# Altium schematic sheet Кнопки_2024-08-19.schdoc
size 404 x 412 mm
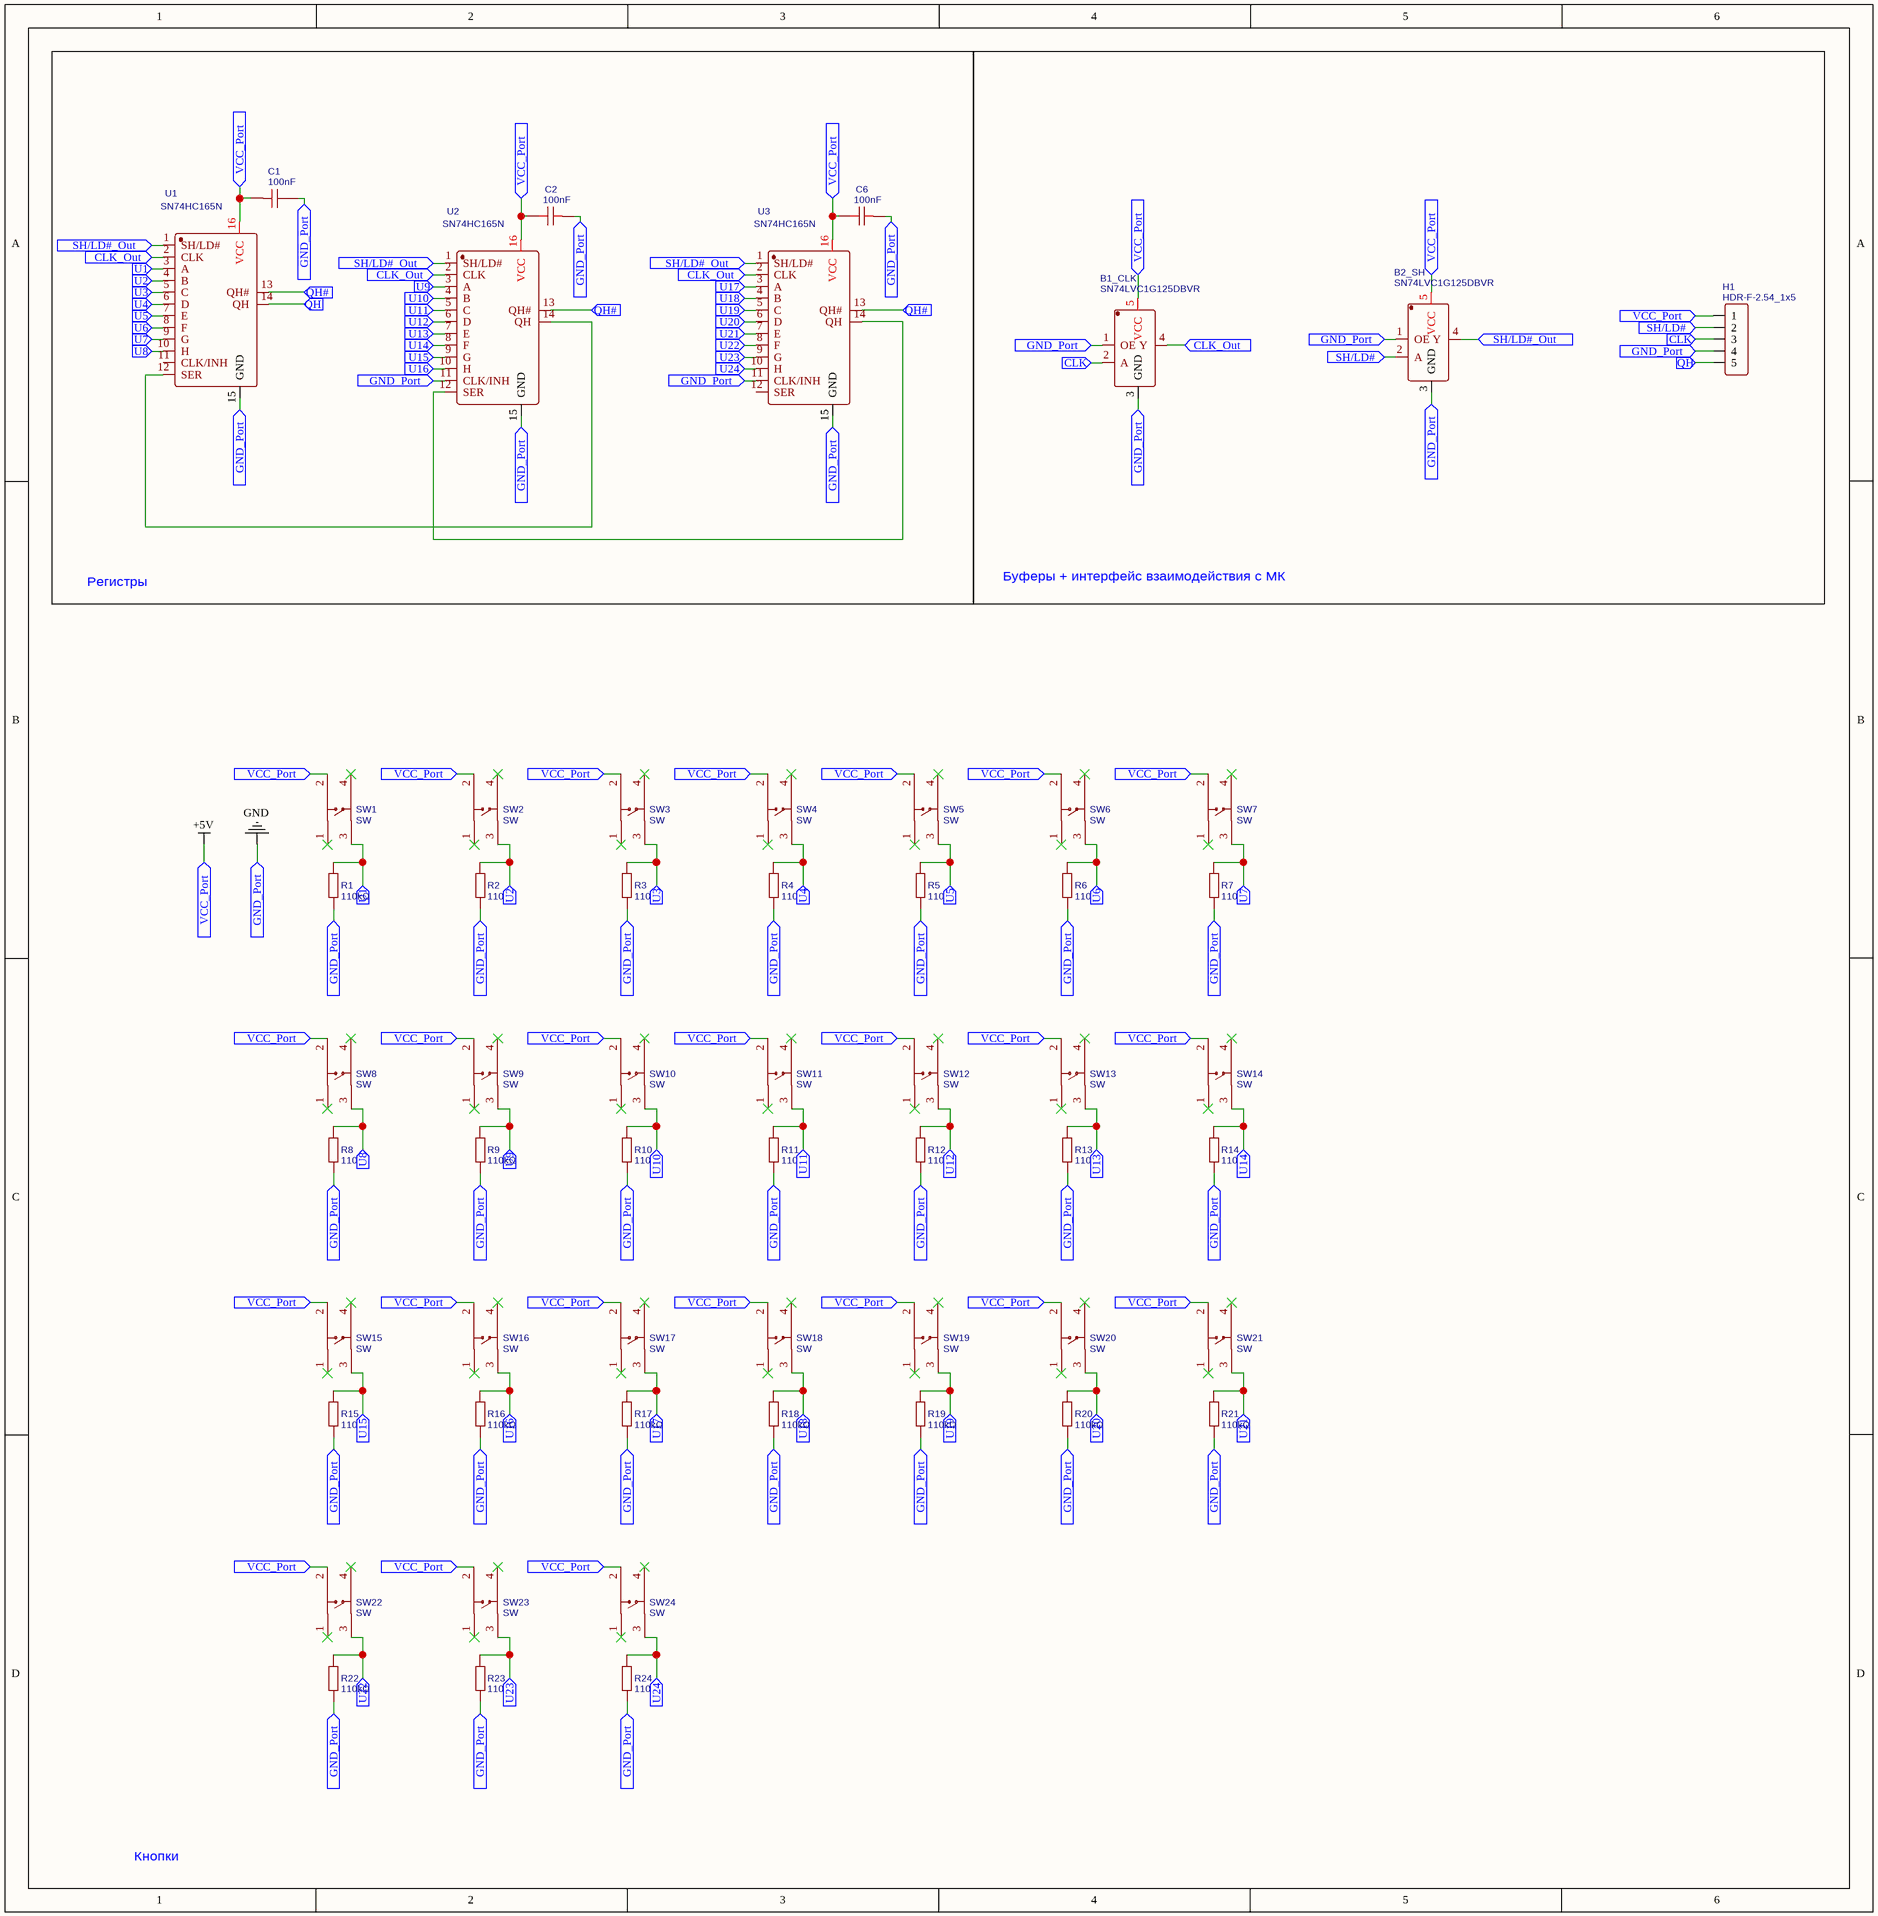
[diagram p0: Кнопки_2024-08-19.schdoc]

## Parts
B1_CLK  SN74LVC1G125DBVR  [SOT-23-5_L3.0-W1.7-P0.95-LS2.8-BL]
B2_SH  SN74LVC1G125DBVR  [SOT-23-5_L3.0-W1.7-P0.95-LS2.8-BL]
C1  100nF  [CAP-TH_L7.2-W2.5-P5.00-D0.5]
C2  100nF  [CAP-TH_L7.2-W2.5-P5.00-D0.5]
C6  100nF  [CAP-TH_L7.2-W2.5-P5.00-D0.5]
H1  HDR-F-2.54_1x5  [HDR-F-2.54_1X5]
R1  110kΩ  [RES-TH_BD2.3-L6.5-P10.50-D0.5]
R2  110kΩ  [RES-TH_BD2.3-L6.5-P10.50-D0.5]
R3  110kΩ  [RES-TH_BD2.3-L6.5-P10.50-D0.5]
R4  110kΩ  [RES-TH_BD2.3-L6.5-P10.50-D0.5]
R5  110kΩ  [RES-TH_BD2.3-L6.5-P10.50-D0.5]
R6  110kΩ  [RES-TH_BD2.3-L6.5-P10.50-D0.5]
R7  110kΩ  [RES-TH_BD2.3-L6.5-P10.50-D0.5]
R8  110kΩ  [RES-TH_BD2.3-L6.5-P10.50-D0.5]
R9  110kΩ  [RES-TH_BD2.3-L6.5-P10.50-D0.5]
R10  110kΩ  [RES-TH_BD2.3-L6.5-P10.50-D0.5]
R11  110kΩ  [RES-TH_BD2.3-L6.5-P10.50-D0.5]
R12  110kΩ  [RES-TH_BD2.3-L6.5-P10.50-D0.5]
R13  110kΩ  [RES-TH_BD2.3-L6.5-P10.50-D0.5]
R14  110kΩ  [RES-TH_BD2.3-L6.5-P10.50-D0.5]
R15  110kΩ  [RES-TH_BD2.3-L6.5-P10.50-D0.5]
R16  110kΩ  [RES-TH_BD2.3-L6.5-P10.50-D0.5]
R17  110kΩ  [RES-TH_BD2.3-L6.5-P10.50-D0.5]
R18  110kΩ  [RES-TH_BD2.3-L6.5-P10.50-D0.5]
R19  110kΩ  [RES-TH_BD2.3-L6.5-P10.50-D0.5]
R20  110kΩ  [RES-TH_BD2.3-L6.5-P10.50-D0.5]
R21  110kΩ  [RES-TH_BD2.3-L6.5-P10.50-D0.5]
R22  110kΩ  [RES-TH_BD2.3-L6.5-P10.50-D0.5]
R23  110kΩ  [RES-TH_BD2.3-L6.5-P10.50-D0.5]
R24  110kΩ  [RES-TH_BD2.3-L6.5-P10.50-D0.5]
SW1  SW  [SW-SMD_4P-L6.0-W6.0-P4.50-LS9.0-2]
SW2  SW  [SW-SMD_4P-L6.0-W6.0-P4.50-LS9.0-2]
SW3  SW  [SW-SMD_4P-L6.0-W6.0-P4.50-LS9.0-2]
SW4  SW  [SW-SMD_4P-L6.0-W6.0-P4.50-LS9.0-2]
SW5  SW  [SW-SMD_4P-L6.0-W6.0-P4.50-LS9.0-2]
SW6  SW  [SW-SMD_4P-L6.0-W6.0-P4.50-LS9.0-2]
SW7  SW  [SW-SMD_4P-L6.0-W6.0-P4.50-LS9.0-2]
SW8  SW  [SW-SMD_4P-L6.0-W6.0-P4.50-LS9.0-2]
SW9  SW  [SW-SMD_4P-L6.0-W6.0-P4.50-LS9.0-2]
SW10  SW  [SW-SMD_4P-L6.0-W6.0-P4.50-LS9.0-2]
SW11  SW  [SW-SMD_4P-L6.0-W6.0-P4.50-LS9.0-2]
SW12  SW  [SW-SMD_4P-L6.0-W6.0-P4.50-LS9.0-2]
SW13  SW  [SW-SMD_4P-L6.0-W6.0-P4.50-LS9.0-2]
SW14  SW  [SW-SMD_4P-L6.0-W6.0-P4.50-LS9.0-2]
SW15  SW  [SW-SMD_4P-L6.0-W6.0-P4.50-LS9.0-2]
SW16  SW  [SW-SMD_4P-L6.0-W6.0-P4.50-LS9.0-2]
SW17  SW  [SW-SMD_4P-L6.0-W6.0-P4.50-LS9.0-2]
SW18  SW  [SW-SMD_4P-L6.0-W6.0-P4.50-LS9.0-2]
SW19  SW  [SW-SMD_4P-L6.0-W6.0-P4.50-LS9.0-2]
SW20  SW  [SW-SMD_4P-L6.0-W6.0-P4.50-LS9.0-2]
SW21  SW  [SW-SMD_4P-L6.0-W6.0-P4.50-LS9.0-2]
SW22  SW  [SW-SMD_4P-L6.0-W6.0-P4.50-LS9.0-2]
SW23  SW  [SW-SMD_4P-L6.0-W6.0-P4.50-LS9.0-2]
SW24  SW  [SW-SMD_4P-L6.0-W6.0-P4.50-LS9.0-2]
U1  SN74HC165N  [DIP-16_L19.8-W6.5-P2.54-LS7.6-BL]
U2  SN74HC165N  [DIP-16_L19.8-W6.5-P2.54-LS7.6-BL]
U3  SN74HC165N  [DIP-16_L19.8-W6.5-P2.54-LS7.6-BL]

## Blocks framed on the sheet
Регистры: C1 C2 C6 U1-U3
Буферы + интерфейс взаимодействия с МК: B1_CLK B2_SH H1

## Ports
CLK (in), CLK_Out (in), GND_Port (in), QH (in), QH# (in), SH/LD# (in), SH/LD#_Out (in), U1 (in), U2 (in), U3 (in), U4 (in), U5 (in), U6 (in), U7 (in), U8 (in), U9 (in), U10 (in), U11 (in), U12 (in), U13 (in), U14 (in), U15 (in), U16 (in), U17 (in), U18 (in), U19 (in), U20 (in), U21 (in), U22 (in), U23 (in), U24 (in), VCC_Port (in)

## Nets
+5V: B1_CLK.5(VCC) B2_SH.5(VCC) C1.1 C2.2 C6.2 H1.1 SW1.2 SW2.2 SW3.2 SW4.2 SW5.2 SW6.2 SW7.2 SW8.2 SW9.2 SW10.2 SW11.2 SW12.2 SW13.2 SW14.2 SW15.2 SW16.2 SW17.2 SW18.2 SW19.2 SW20.2 SW21.2 SW22.2 SW23.2 SW24.2 U1.16(VCC) U2.16(VCC) U3.16(VCC) ; port VCC_Port
GND: B1_CLK.1(OE) B1_CLK.3(GND) B2_SH.1(OE) B2_SH.3(GND) C1.2 C2.1 C6.1 H1.4 R1.2 R2.2 R3.2 R4.2 R5.2 R6.2 R7.2 R8.2 R9.2 R10.2 R11.2 R12.2 R13.2 R14.2 R15.2 R16.2 R17.2 R18.2 R19.2 R20.2 R21.2 R22.2 R23.2 R24.2 U1.15(GND) U2.11(CLK/INH) U2.15(GND) U3.11(CLK/INH) U3.15(GND) ; port GND_Port
CLK: B1_CLK.2(A) H1.3 ; port CLK
CLK_Out: B1_CLK.4(Y) U1.2(CLK) U2.2(CLK) U3.2(CLK) ; port CLK_Out
QH: H1.5 U1.14(QH) ; port QH
QH#: U1.13(QH#) U2.13(QH#) U3.13(QH#) ; port QH#
SH/LD#: B2_SH.2(A) H1.2 ; port SH/LD#
SH/LD#_Out: B2_SH.4(Y) U1.1(SH/LD#) U2.1(SH/LD#) U3.1(SH/LD#) ; port SH/LD#_Out
U1: R1.1 SW1.3 U1.3(A) ; port U1
U2: R2.1 SW2.3 U1.4(B) ; port U2
U3: R3.1 SW3.3 U1.5(C) ; port U3
U4: R4.1 SW4.3 U1.6(D) ; port U4
U5: R5.1 SW5.3 U1.7(E) ; port U5
U6: R6.1 SW6.3 U1.8(F) ; port U6
U7: R7.1 SW7.3 U1.9(G) ; port U7
U8: R8.1 SW8.3 U1.10(H) ; port U8
U9: R9.1 SW9.3 U2.3(A) ; port U9
U10: R10.1 SW10.3 U2.4(B) ; port U10
U11: R11.1 SW11.3 U2.5(C) ; port U11
U12: R12.1 SW12.3 U2.6(D) ; port U12
U13: R13.1 SW13.3 U2.7(E) ; port U13
U14: R14.1 SW14.3 U2.8(F) ; port U14
U15: R15.1 SW15.3 U2.9(G) ; port U15
U16: R16.1 SW16.3 U2.10(H) ; port U16
U17: R17.1 SW17.3 U3.3(A) ; port U17
U18: R18.1 SW18.3 U3.4(B) ; port U18
U19: R19.1 SW19.3 U3.5(C) ; port U19
U20: R20.1 SW20.3 U3.6(D) ; port U20
U21: R21.1 SW21.3 U3.7(E) ; port U21
U22: R22.1 SW22.3 U3.8(F) ; port U22
U23: R23.1 SW23.3 U3.9(G) ; port U23
U24: R24.1 SW24.3 U3.10(H) ; port U24
NetU1_12: U1.12(SER) U2.14(QH)
NetU2_12: U2.12(SER) U3.14(QH)

Not connected (* = marked no-connect by the designer): SW1 1* 4*; SW2 1* 4*; SW3 1* 4*; SW4 1* 4*; SW5 1* 4*; SW6 1* 4*; SW7 1* 4*; SW8 1* 4*; SW9 1* 4*; SW10 1* 4*; SW11 1* 4*; SW12 1* 4*; SW13 1* 4*; SW14 1* 4*; SW15 1* 4*; SW16 1* 4*; SW17 1* 4*; SW18 1* 4*; SW19 1* 4*; SW20 1* 4*; SW21 1* 4*; SW22 1* 4*; SW23 1* 4*; SW24 1* 4*; U1 11(CLK/INH); U3 12(SER)

## Notes on the sheet
- Кнопки

## Library data of the parts
B1_CLK B2_SH = SN74LVC1G125DBVR: Manufacturer: TI(德州仪器); Contributor: danik_mus; spicePre: X; Supplier: LCSC; Manufacturer Part: SN74LVC1G125DBVR; Supplier Part: C23654; JLCPCB Part Class: Extended Part; spiceSymbolName: SN74LVC1G125DBVR
C1 C2 C6 = 100nF: Manufacturer: KYET(科雅); Manufacturer Part: PE104J2A0504; Contributor: lcsc; nameAlias: Value; Supplier: LCSC; Supplier Part: C3019037; JLCPCB Part Class: Extended Part; spicePre: U; spiceSymbolName: PE104J2A0504
H1 = HDR-F-2.54_1x5: Contributor: LCEDA_Lib; Supplier Part: C50950; Supplier: LCSC; spicePre: H; spiceSymbolName: HDR-F-2.54_1x5
R1-R24 = 110kΩ: Manufacturer: CCO(千志电子); Manufacturer Part: CF1/4W-110KΩ±5% T52; nameAlias: Value; Contributor: LCSC; Supplier: LCSC; Supplier Part: C120104; JLCPCB Part Class: Extended Part; spicePre: R; spiceSymbolName: CF1/4W-110KΩ±5% T52
SW1-SW24 = SW: Manufacturer: null; Manufacturer Part: 按键; Contributor: lcsc; Supplier: LCSC; Supplier Part: C9900024939; JLCPCB Part Class: Extended Part; spicePre: U; spiceSymbolName: SW
U1-U3 = SN74HC165N: Manufacturer: TI(德州仪器); Contributor: danik_mus; spicePre: X; Supplier: LCSC; Manufacturer Part: SN74HC165N; Supplier Part: C2909; JLCPCB Part Class: Extended Part; spiceSymbolName: SN74HC165N